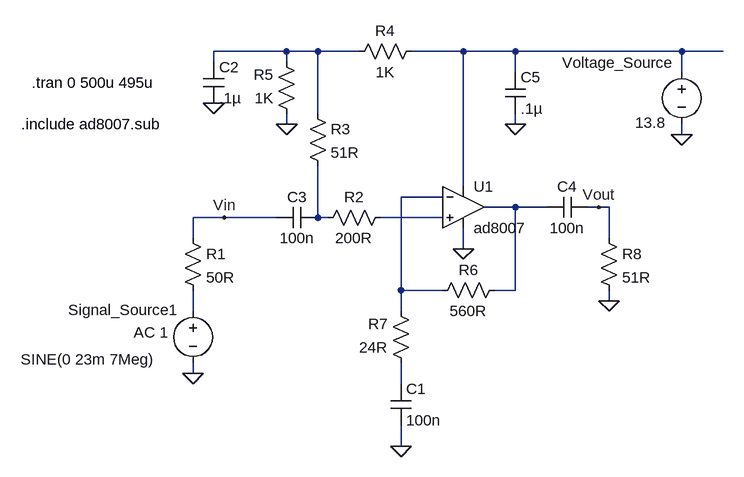
[diagram p0: schematic Power Amp AD8008 PreDriver Testing.asc]
Power Amp AD8008 PreDriver Testing.asc, the LTspice schematic file:
Version 4
SHEET 1 2716 3076
WIRE -304 1760 -416 1760
WIRE -256 1760 -304 1760
WIRE -192 1760 -256 1760
WIRE -32 1760 -112 1760
WIRE 48 1760 -32 1760
WIRE 304 1760 48 1760
WIRE 368 1760 304 1760
WIRE -416 1776 -416 1760
WIRE -304 1776 -304 1760
WIRE 48 1792 48 1760
WIRE 304 1792 304 1760
WIRE -256 1856 -256 1760
WIRE -304 1872 -304 1856
WIRE 48 1872 48 1856
WIRE 304 1888 304 1872
WIRE -32 1968 -32 1760
WIRE -64 1984 -128 1984
WIRE 48 2000 0 2000
WIRE 96 2000 48 2000
WIRE 176 2000 160 2000
WIRE 192 2000 176 2000
WIRE -400 2016 -448 2016
WIRE -320 2016 -400 2016
WIRE -256 2016 -256 1936
WIRE -240 2016 -256 2016
WIRE -64 2016 -160 2016
WIRE -448 2048 -448 2016
WIRE 192 2048 192 2000
WIRE -32 2064 -32 2032
WIRE -128 2128 -128 1984
WIRE -64 2128 -128 2128
WIRE 48 2128 48 2000
WIRE 48 2128 16 2128
WIRE 192 2144 192 2128
WIRE -448 2160 -448 2128
WIRE -128 2160 -128 2128
WIRE -448 2256 -448 2240
WIRE -128 2272 -128 2240
WIRE -128 2368 -128 2336
FLAG 304 1888 0
FLAG -448 2256 0
FLAG 48 1872 0
FLAG -400 2016 Vin
FLAG -32 2064 0
FLAG -304 1872 0
FLAG -128 2368 0
FLAG 192 2144 0
FLAG -416 1840 0
FLAG 176 2000 Vout
SYMBOL voltage 304 1776 R0
WINDOW 123 0 0 Left 2
WINDOW 39 0 0 Left 2
WINDOW 0 -184 1 Left 2
WINDOW 3 -72 94 Left 2
SYMATTR InstName Voltage_Source
SYMATTR Value 13.8
SYMBOL voltage -448 2144 R0
WINDOW 3 -265 90 Left 2
WINDOW 123 -91 49 Left 2
WINDOW 0 -192 14 Left 2
WINDOW 39 0 0 Left 2
SYMATTR Value SINE(0 23m 7Meg)
SYMATTR Value2 AC 1
SYMATTR InstName Signal_Source1
SYMBOL res -464 2032 R0
SYMATTR InstName R1
SYMATTR Value 50R
SYMBOL cap -256 2000 R90
WINDOW 0 0 32 VBottom 2
WINDOW 3 32 32 VTop 2
SYMATTR InstName C3
SYMATTR Value 100n
SYMBOL cap 32 1792 R0
SYMATTR InstName C5
SYMATTR Value .1µ
SYMBOL Opamps\\UniversalOpamp2 -32 2000 R0
SYMATTR InstName U1
SYMATTR SpiceModel ""
SYMATTR Value2 ""
SYMATTR SpiceLine ""
SYMATTR SpiceLine2 ""
SYMATTR Value ad8007
SYMBOL res -144 2000 R90
WINDOW 0 0 56 VBottom 2
WINDOW 3 32 56 VTop 2
SYMATTR InstName R2
SYMATTR Value 200R
SYMBOL res -272 1840 R0
SYMATTR InstName R3
SYMATTR Value 51R
SYMBOL res -96 1744 R90
WINDOW 0 0 56 VBottom 2
WINDOW 3 32 56 VTop 2
SYMATTR InstName R4
SYMATTR Value 1K
SYMBOL res -288 1872 R180
WINDOW 0 36 76 Left 2
WINDOW 3 36 40 Left 2
SYMATTR InstName R5
SYMATTR Value 1K
SYMBOL res 32 2112 R90
WINDOW 0 0 56 VBottom 2
WINDOW 3 32 56 VTop 2
SYMATTR InstName R6
SYMATTR Value 560R
SYMBOL res -112 2256 R180
WINDOW 0 36 76 Left 2
WINDOW 3 36 40 Left 2
SYMATTR InstName R7
SYMATTR Value 24R
SYMBOL cap -144 2272 R0
SYMATTR InstName C1
SYMATTR Value 100n
SYMBOL res 176 2032 R0
SYMATTR InstName R8
SYMATTR Value 51R
SYMBOL cap -432 1776 R0
SYMATTR InstName C2
SYMATTR Value .1µ
SYMBOL cap 160 1984 R90
WINDOW 0 0 32 VBottom 2
WINDOW 3 32 32 VTop 2
SYMATTR InstName C4
SYMATTR Value 100n
TEXT -696 1808 Left 2 !.tran 0 500u 495u
TEXT -712 1872 Left 2 !.include ad8007.sub

The netlist it stands for:
* Power Amp AD8008 PreDriver Testing.asc
Voltage_Source N002 0 13.8
V§Signal_Source1 N007 0 SINE(0 23m 7Meg) AC 1
R1 Vin N007 50R
C3 N005 Vin 100n
C5 N002 0 .1µ
XU1 N006 N003 N002 0 N004 ad8007  ; pins IN+ IN- V+ V- OUT
R2 N006 N005 200R
R3 N001 N005 51R
R4 N002 N001 1K
R5 0 N001 1K
R6 N004 N003 560R
R7 N008 N003 24R
C1 N008 0 100n
R8 Vout 0 51R
C2 N001 0 .1µ
C4 Vout N004 100n
.tran 0 500u 495u
.include ad8007.sub
.lib UniversalOpamps2.sub
.backanno
.end